# EAGLE design M452XX (EAGLE 6.6.0)
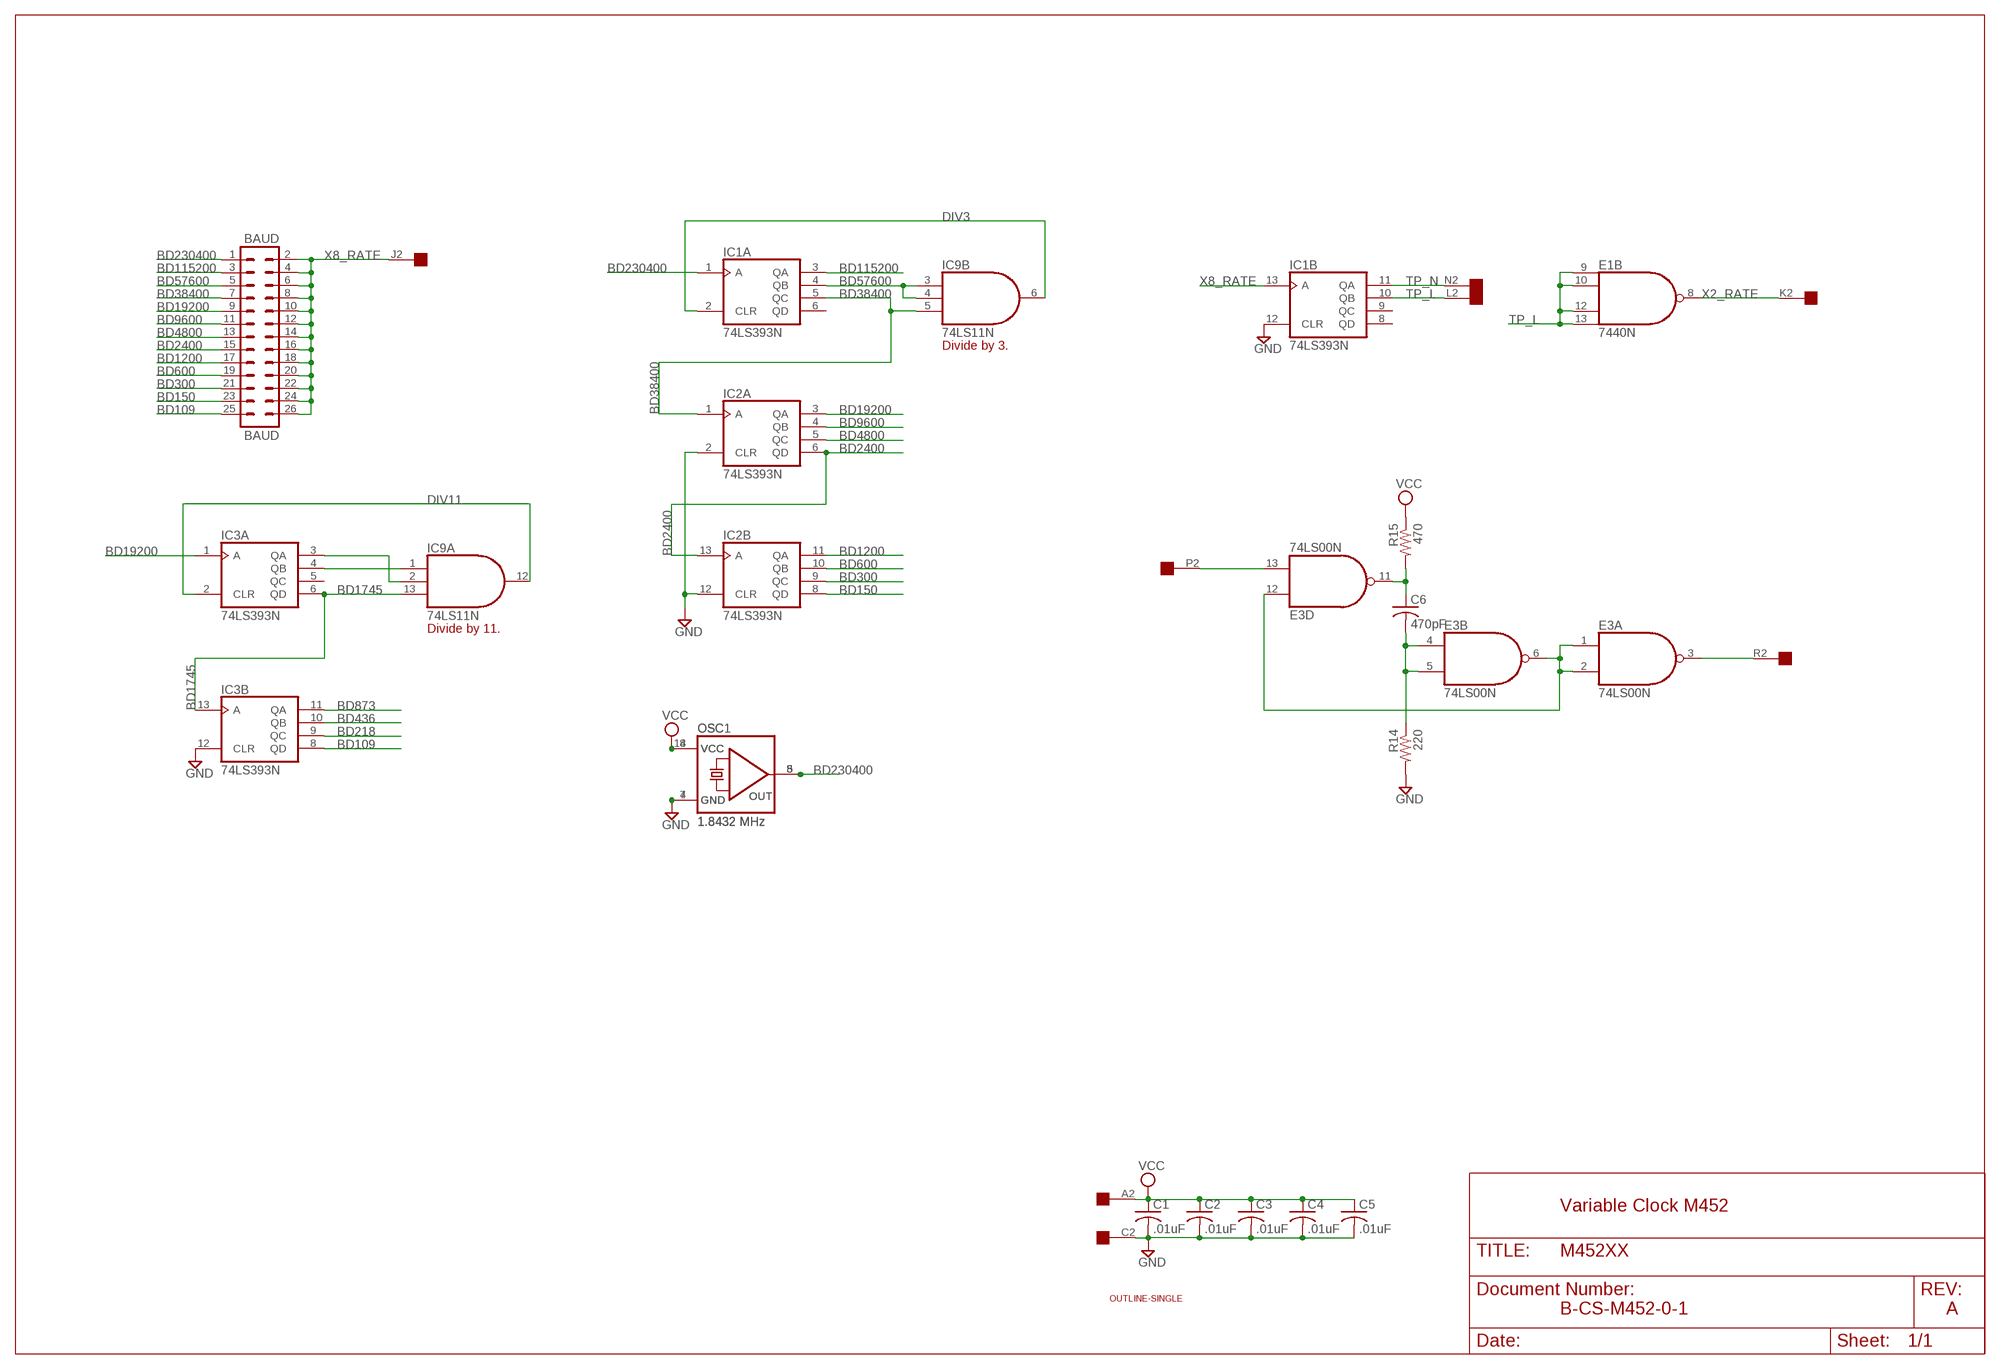
[diagram p0: schematic, sheet 1]

## Parts
BAUD  BAUD  MA13-2  [MA13-2]
C1  .01uF  C-US050-025X075  [C050-025X075]
C2  .01uF  C-US050-025X075  [C050-025X075]
C3  .01uF  C-US050-025X075  [C050-025X075]
C4  .01uF  C-US050-025X075  [C050-025X075]
C5  .01uF  C-US050-025X075  [C050-025X075]
C6  470pF  C-US150-054X183  [C150-054X183]
E1  7440N  74S20N  [DIL14]
E3  74LS00N  [DIL14]
IC1  74LS393N  [DIL14]
IC2  74LS393N  [DIL14]
IC3  74LS393N  [DIL14]
IC9  74LS11N  [DIL14]
OSC  1.8432 MHz  QG5460  [DIL08S]
OSC1  1.8432 MHz  QG5860  [DIL14S]
R14  220  R-US_0207/10  [0207/10]
R15  470  R-US_0207/10  [0207/10]
U$1  OUTLINE-SINGLE  [SINGLE]
U$2  EDGE-1  [EDGE-CON1]

## Nets
BD109: BAUD.25 IC3.8(B:QD)
BD150: BAUD.23 IC2.8(B:QD)
BD218: IC3.9(B:QC)
BD300: BAUD.21 IC2.9(B:QC)
BD436: IC3.10(B:QB)
BD600: BAUD.19 IC2.10(B:QB)
BD873: IC3.11(B:QA)
BD1200: BAUD.17 IC2.11(B:QA)
BD1745: IC3.6(A:QD) IC3.13(B:A) IC9.13(A:I2)
BD2400: BAUD.15 IC2.6(A:QD) IC2.13(B:A)
BD4800: BAUD.13 IC2.5(A:QC)
BD9600: BAUD.11 IC2.4(A:QB)
BD19200: BAUD.9 IC2.3(A:QA) IC3.1(A:A)
BD38400: BAUD.7 IC1.5(A:QC) IC2.1(A:A) IC9.5(B:I2)
BD57600: BAUD.5 IC1.4(A:QB) IC9.3(B:I0) IC9.4(B:I1)
BD115200: BAUD.3 IC1.3(A:QA)
BD230400: BAUD.1 IC1.1(A:A) OSC1.8(OUT) OSC.5(OUT)
DIV3 [Supply]: IC1.2(A:CLR) IC9.6(B:O)
DIV11: IC3.2(A:CLR) IC9.12(A:O)
GND [Supply]: C1.2 C2.2 C3.2 C4.2 C5.2 IC1.12(B:CLR) IC2.2(A:CLR) IC2.12(B:CLR) IC3.12(B:CLR) OSC1.7(GND) OSC.4(GND) R14.2 U$2.C2
N$12: E3.13(D:I1) U$2.P2
N$14: C6.2 E3.4(B:I0) E3.5(B:I1) R14.1
N$16: C6.1 E3.11(D:O) R15.2
N$17: E3.1(A:I0) E3.2(A:I1) E3.6(B:O) E3.12(D:I0)
N$21: E3.3(A:O) U$2.R2
N$24: IC3.3(A:QA) IC9.2(A:I1)
N$25: IC3.4(A:QB) IC9.1(A:I0)
TP_L: E1.9(B:I0) E1.10(B:I1) E1.12(B:I2) E1.13(B:I3) IC1.10(B:QB) U$2.L2
TP_N: IC1.11(B:QA) U$2.N2
VCC [Supply]: C1.1 C2.1 C3.1 C4.1 C5.1 OSC1.14(VCC) OSC.8(VCC) R15.1 U$2.A2
X2_RATE: E1.8(B:O) U$2.K2
X8_RATE: BAUD.2 BAUD.4 BAUD.6 BAUD.8 BAUD.10 BAUD.12 BAUD.14 BAUD.16 BAUD.18 BAUD.20 BAUD.22 BAUD.24 BAUD.26 IC1.13(B:A) U$2.J2
Unconnected: E1.1(A:I0) E1.2(A:I1) E1.4(A:I2) E1.5(A:I3) E1.6(A:O) E3.8(C:O) E3.9(C:I0) E3.10(C:I1) IC1.6(A:QD) IC1.8(B:QD) IC1.9(B:QC) IC3.5(A:QC) IC9.8(C:O) IC9.9(C:I0) IC9.10(C:I1) IC9.11(C:I2) U$2.B2 U$2.D2 U$2.E2 U$2.F2 U$2.H2 U$2.M2 U$2.S2 U$2.T2 U$2.U2 U$2.V2

## Notes on the sheet
- Divide by 3.
- Divide by 11.
- Variable Clock M452
- B-CS-M452-0-1 | A

## Power pins joined to a net without a drawn wire
GND: E1.7(P:GND) E3.7(P:GND) IC1.7(P:GND) IC2.7(P:GND) IC3.7(P:GND) IC9.7(P:GND)
VCC: E1.14(P:VCC) E3.14(P:VCC) IC1.14(P:VCC) IC2.14(P:VCC) IC3.14(P:VCC) IC9.14(P:VCC)

## Library data of the parts
BAUD = con-lstb:MA13-2: PIN HEADER; OC_FARNELL: unknown; OC_NEWARK: unknown
C1-C6 = rcl:C-US: CAPACITOR, American symbol
E1 = 74xx-us:74*20: Dual 4-input NAND gate
E3 = 74xx-us:74*00: Quad 2-input NAND gate
IC1-IC3 = 74xx-us:74*393: Dual 4-bit decade and binary COUNTER
IC9 = 74xx-us:74*11: Triple 3-input AND gate
OSC = crystal:QG5460: CRYSTAL RESONATOR; OC_FARNELL: unknown; OC_NEWARK: unknown
OSC1 = crystal:QG5860: CRYSTAL RESONATOR; OC_FARNELL: unknown; OC_NEWARK: unknown
R14 R15 = rcl:R-US_: RESISTOR, American symbol
U$1 = dec-con:OUTLINE-*: Board outlines for DEC boards.
U$2 = dec-con:EDGE-1: Single-Sided DEC Edge Connector -- (side 2)

## Net classes
1 Supply: width 0.813 mm

## Board
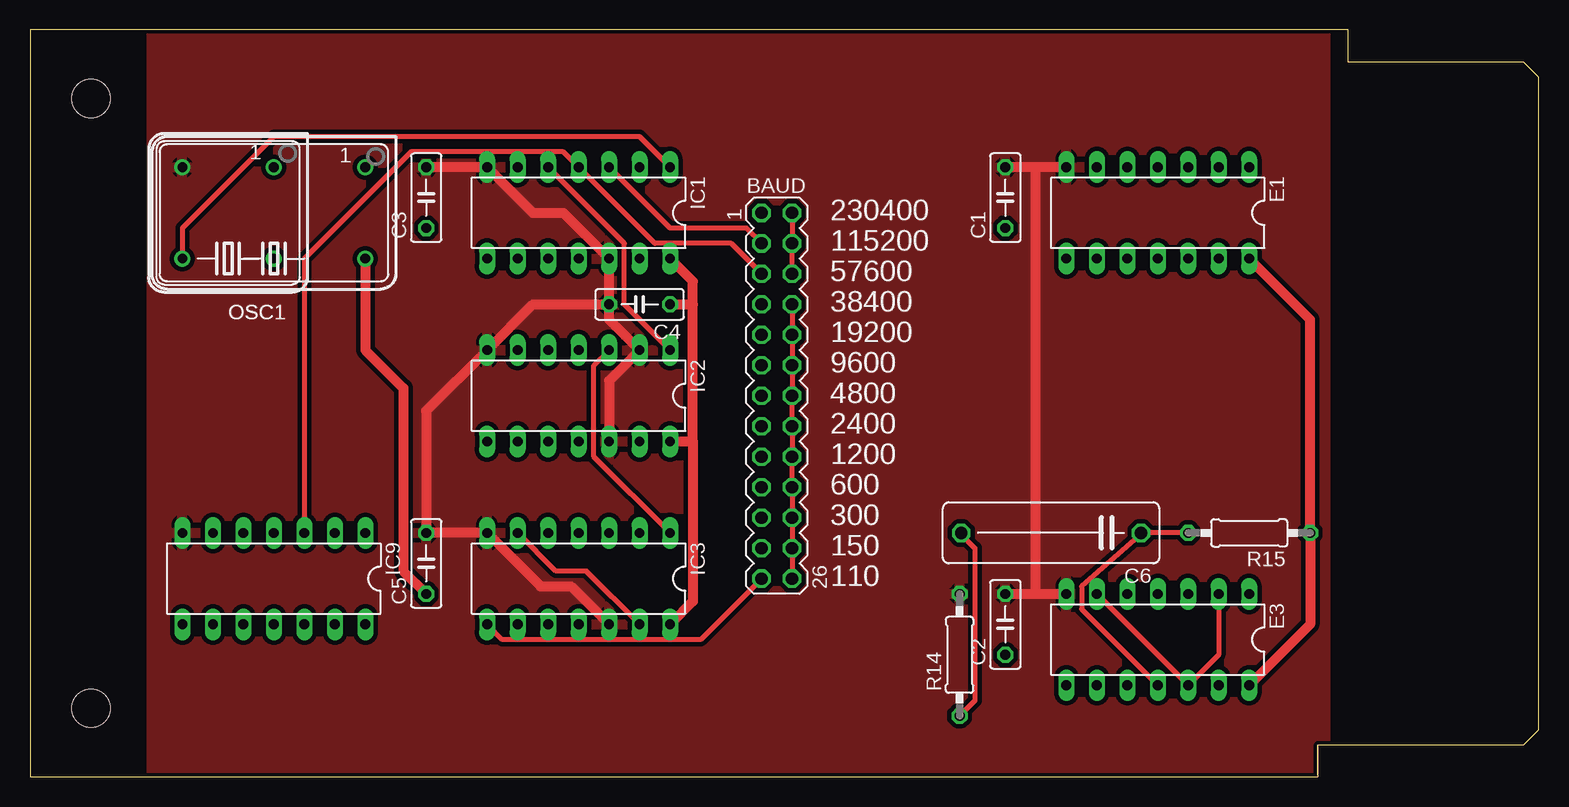
[diagram p1: board, top side]
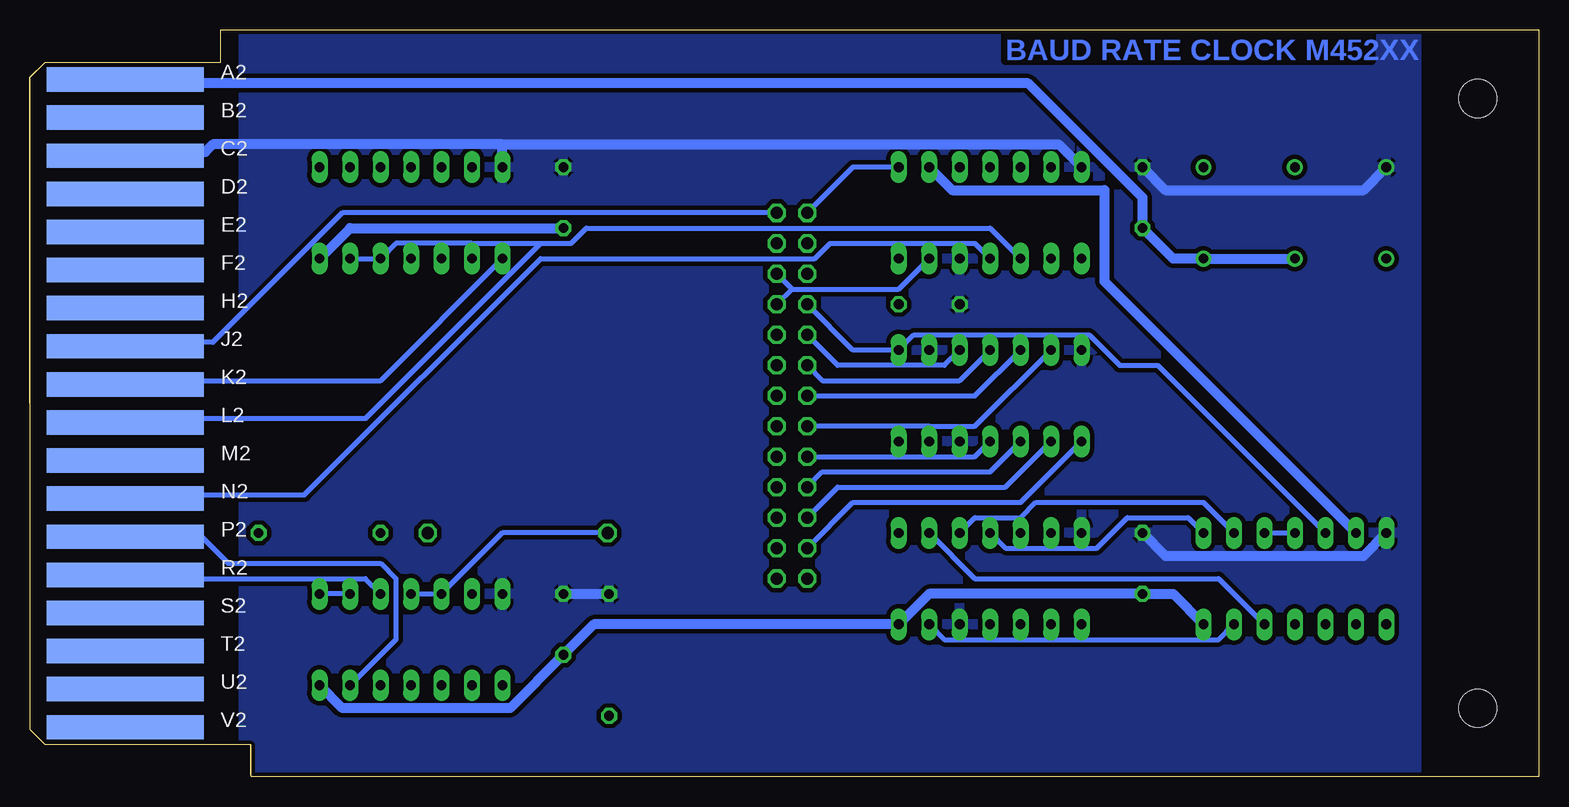
[diagram p2: board, bottom side, seen from below]

Size 125.73 x 62.23 mm. Coordinates in mm from the lower left corner, seen from the top.
Copper layers (1+16): Top 0.035mm / dielectric 1.5mm / Bottom 0.035mm
Design rules "16mils": minimum track width 16mil, minimum drill 32mil, track to track 15mil, track to pad 10mil, pad to pad 10mil, via to via 10mil, smd to smd 10mil, copper to edge 13mil, drill to drill 10mil, minimum pad ring 10mil, minimum via ring 8mil, stop-mask expansion 0mil, vias tented up to drill 0mil, thermal gap 10mil

### Footprints (pad centres in the part's own frame; a part is rotated, then mirrored left to right if it is on the bottom)
MA13-2 = drill 1.016 octagon: 1 -15.24,-1.27; 2 -15.24,1.27; 3 -12.7,-1.27; 4 -12.7,1.27; 5 -10.16,-1.27; 6 -10.16,1.27; 7 -7.62,-1.27; 8 -7.62,1.27; 9 -5.08,-1.27; 10 -5.08,1.27; 11 -2.54,-1.27; 12 -2.54,1.27; 13 0,-1.27; 14 0,1.27; 15 2.54,-1.27; 16 2.54,1.27; 17 5.08,-1.27; 18 5.08,1.27; 19 7.62,-1.27; 20 7.62,1.27; 21 10.16,-1.27; 22 10.16,1.27; 23 12.7,-1.27; 24 12.7,1.27; 25 15.24,-1.27; 26 15.24,1.27
C050-025X075 = drill 0.813 octagon: 1 -2.54,0; 2 2.54,0
C150-054X183 = drill 1.016 octagon: 1 -7.493,0; 2 7.493,0
DIL14 = drill 0.813 long: 1 -7.62,-3.81; 2 -5.08,-3.81; 3 -2.54,-3.81; 4 0,-3.81; 5 2.54,-3.81; 6 5.08,-3.81; 7 7.62,-3.81; 8 7.62,3.81; 9 5.08,3.81; 10 2.54,3.81; 11 0,3.81; 12 -2.54,3.81; 13 -5.08,3.81; 14 -7.62,3.81
DIL08S = drill 0.813: 1 -3.81,-3.81; 4 3.81,-3.81; 5 3.81,3.81; 8 -3.81,3.81
DIL14S = drill 0.813: 1 -7.62,-3.81; 7 7.62,-3.81; 8 7.62,3.81; 14 -7.62,3.81
0207/10 = drill 0.813 octagon: 1 -5.08,0; 2 5.08,0
SINGLE = hole 3.175: 120.65,56.515; 120.65,5.715
EDGE-CON1 = smd 13.106 x 2.032 bottom: A2 7.938,4.128; B2 7.938,7.303; C2 7.938,10.477; D2 7.938,13.652; E2 7.938,16.828; F2 7.938,20.003; H2 7.938,23.177; J2 7.938,26.352; K2 7.938,29.527; L2 7.938,32.703; M2 7.938,35.877; N2 7.938,39.053; P2 7.938,42.227; R2 7.938,45.403; S2 7.938,48.578; T2 7.938,51.752; U2 7.938,54.928; V2 7.938,58.102

### Placement (x,y rotation side)
BAUD  62.23,31.75 270 top
C1  81.28,48.26 90 top
C2  81.28,12.7 90 top
C3  33.02,48.26 90 top
C4  50.8,39.37 180 top
C5  33.02,17.78 90 top
C6  85.09,20.32 180 top
E1  93.98,46.99 180 top
E3  93.98,11.43 180 top
IC1  45.72,46.99 180 top
IC2  45.72,31.75 180 top
IC3  45.72,16.51 180 top
IC9  20.32,16.51 180 top
OSC  16.51,46.99 180 top
OSC1  20.32,46.99 180 top
R14  77.47,10.16 90 top
R15  101.6,20.32 180 top
U$1  125.73,62.23 180 top
U$2  125.73,62.23 180 top

### Tracks (layer width: path | path; a pad name or v marks a point on that pad's centre or on a via)
BD109
  Top 0.406: IC3.8 39.37,11.43 55.88,11.43 BAUD.25
BD150
  Bottom 0.406: IC2.8 43.18,22.86 57.15,22.86 BAUD.23
BD300
  Bottom 0.406: IC2.9 44.45,24.13 58.42,24.13 BAUD.21
BD600
  Bottom 0.406: IC2.10 45.72,25.4 59.69,25.4 BAUD.19
BD1200
  Bottom 0.406: IC2.11 46.99,26.67 BAUD.17
BD1745
  Top 0.406: IC3.6 43.81,17.14 46.35,17.14 IC3.13
  Bottom 0.406: IC9.13 26.67,11.43 49.53,11.43 IC3.13
BD2400
  Bottom 0.406: IC2.6 46.99,29.21 50.8,29.21 | 50.8,29.21 BAUD.15 | IC2.13 50.8,29.21
BD4800
  Bottom 0.406: IC2.5 46.99,31.75 BAUD.13
BD9600
  Bottom 0.406: IC2.4 48.26,33.02 59.69,33.02 BAUD.11
BD19200
  Top 0.406: IC3.1 46.99,26.67 46.99,34.29 IC2.3
  Bottom 0.406: IC2.3 49.53,34.29 58.42,34.29 BAUD.9
BD38400
  Top 0.406: IC1.5 49.53,44.45 49.53,39.37 IC2.1
  Bottom 0.406: IC9.5 31.75,34.29 34.92,34.29 37.47,36.83 52.07,36.83 IC2.1 57.15,35.56 BAUD.7
BD57600
  Top 0.406: BAUD.5 58.42,44.45 52.07,44.45 IC1.4 44.45,52.07 31.75,52.07 22.86,43.18 IC9.3
  Bottom 0.406: IC9.3 IC9.4
BD115200
  Top 0.406: IC1.3 53.34,45.72 59.69,45.72 BAUD.3
BD230400
  Top 0.406: OSC.5 12.7,45.72 20.32,53.34 50.8,53.34 IC1.1
  Bottom 0.406: BAUD.1 57.15,50.8 IC1.1
DIV3
  Bottom 0.813: IC9.6 36.2,41.27 36.2,48.9 48.9,48.9 IC1.2
DIV11
  Bottom 0.406: IC9.12 26.67,16.51 46.99,16.51 IC3.2
GND
  Top 0.813: IC3.12 45.09,15.88 42.55,15.88 IC3.7 C5.2 33.02,30.48 IC2.7 41.91,39.37 C4.2 | IC2.12 48.26,33.02 IC2.2 48.26,38.1 C4.2 | C4.2 IC1.12 44.45,46.99 41.91,46.99 IC1.7 C3.2 | E1.7 83.82,50.8 | 83.82,50.8 C1.2 | C2.2 83.82,15.24 | 83.82,15.24 E3.7 | 83.82,15.24 83.82,50.8
  Bottom 0.813: OSC1.7 14.61,48.9 31.11,48.9 C3.2 | C2.2 R14.2 | 86.36,52.7 110.49,52.7 111.12,52.07 117.47,52.07 U$2.C2 | E1.7 86.36,52.7 | IC1.7 40.01,52.7 86.36,52.7 | IC9.7 14.61,18.41 31.11,18.41 C5.2
  pour Top: 10.16,0 10.16,62.23 107.95,62.23 107.95,0
  pour Bottom: 10.16,0 10.16,62.23 107.95,62.23 107.95,0
N$12
  Bottom 0.406: U$2.P2 116.84,20 116.84,20.32 111.76,20.32 109.22,17.78 96.52,17.78 95.25,16.51 95.25,11.43 E3.13
N$14
  Top 0.406: R14.1 78.74,6.35 78.74,19.05 78.11,19.68 C6.2
  Bottom 0.406: E3.4 E3.5 86.36,20.32 C6.2
N$16
  Top 0.406: R15.2 92.71,20.32 | 92.71,20.32 87.63,15.88 87.63,13.97 E3.11 | 92.71,20.32 C6.1
N$17
  Top 0.406: E3.2 99.06,10.16 E3.12 E3.6
  Bottom 0.406: E3.2 E3.1
N$21
  Bottom 0.406: E3.3 97.79,16.51 117.47,16.51 U$2.R2
N$24
  Bottom 0.406: IC3.3 46.99,21.59 43.18,21.59 41.91,22.86 27.94,22.86 IC9.2
N$25
  Bottom 0.406: IC3.4 44.45,19.05 36.83,19.05 34.29,21.59 29.21,21.59 IC9.1
TP_L
  Bottom 0.406: E1.13 E1.12 95.25,44.45 91.44,44.45 | IC1.10 45.72,45.72 79.38,45.72 80.64,44.45 83.19,44.45 | 88.9,44.45 83.19,44.45 | E1.9 88.9,44.45 | 88.9,44.45 91.44,44.45 | 91.44,44.45 E1.10 | 83.19,44.45 97.79,29.84 117.47,29.84 U$2.L2
TP_N
  Bottom 0.406: IC1.11 46.99,44.45 59.05,44.45 60.33,43.18 83.19,43.18 102.87,23.5 117.47,23.5 U$2.N2
VCC
  Top 0.813: E1.14 106.68,38.1 R15.1 106.68,12.7 E3.14 | OSC1.14 27.94,35.56 31.11,32.38 31.11,17.14 C5.1 | IC1.14 55.24,41.27 55.24,39.37 | 55.24,27.94 55.24,39.37 | C4.1 55.24,39.37 | IC2.14 55.24,27.94 | 55.24,27.94 55.24,14.61 IC3.14
  Bottom 0.813: C1.1 99.06,45.72 E1.14 | IC9.14 30.48,15.24 C5.1 50.8,15.24 IC3.14 78.74,12.7 C2.1 85.72,5.71 99.69,5.71 E3.14 | OSC.8 OSC1.14 30.48,43.18 C3.1 33.02,48.26 42.55,57.78 117.47,57.78 U$2.A2
X2_RATE
  Bottom 0.406: E1.8 96.52,33.02 117.47,33.02 U$2.K2
X8_RATE
  Top 0.406: BAUD.26 BAUD.24 BAUD.22 BAUD.20 BAUD.18 BAUD.16 BAUD.14 BAUD.12 BAUD.10 BAUD.8 | BAUD.2 BAUD.4 BAUD.6
  Bottom 0.406: IC1.13 53.34,40.64 62.23,40.64 | BAUD.6 62.23,40.64 | 62.23,40.64 BAUD.8 | BAUD.2 99.69,46.99 110.49,36.2 117.47,36.2 U$2.J2

### Text on the board
Bottom: BAUD RATE CLOCK M452XX
tNames: 230400 | 115200 | 57600 | 38400 | 19200 | 9600 | 4800 | 2400 | 1200 | 600 | 300 | 150 | 110